# EAGLE design vga_jfet (EAGLE 7.2.0)
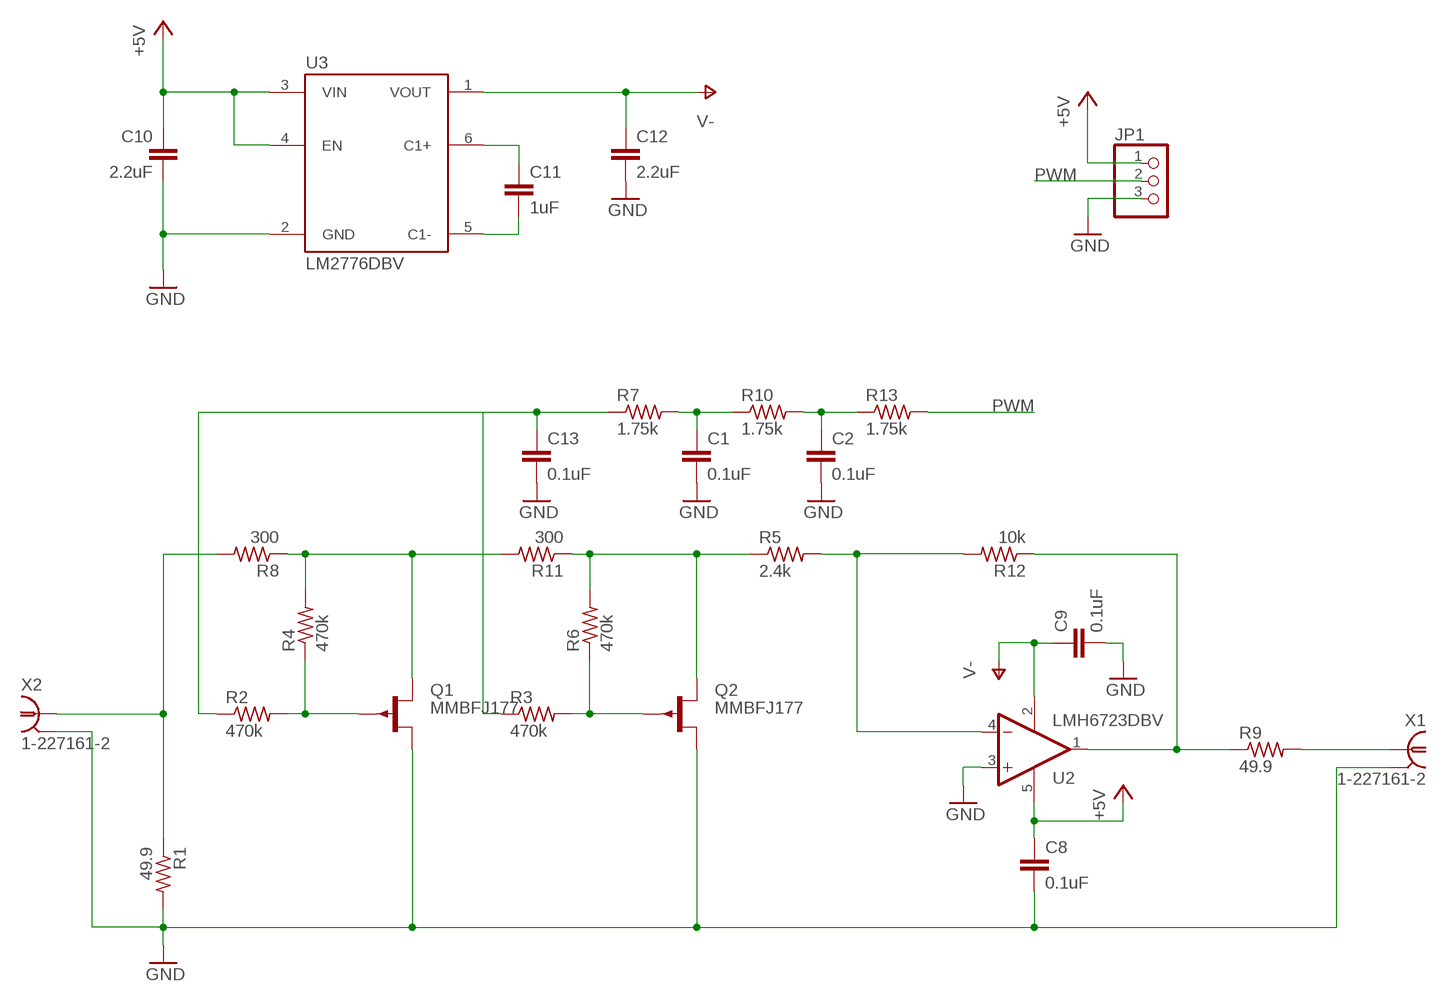
[diagram p0: schematic, sheet 1]

## Parts
C1  0.1uF  C-EUC0603  [C0603]
C2  0.1uF  C-EUC0603  [C0603]
C8  0.1uF  C-EUC0603  [C0603]
C9  0.1uF  C-EUC0603  [C0603]
C10  2.2uF  C-EUC0603  [C0603]
C11  1uF  C-EUC0603  [C0603]
C12  2.2uF  C-EUC0603  [C0603]
C13  0.1uF  C-EUC0603  [C0603]
JP1  PINHD-1X3  [1X03]
Q1  MMBFJ177  [SOT23]
Q2  MMBFJ177  [SOT23]
R1  49.9  R-US_R0603  [R0603]
R2  470k  R-US_R0603  [R0603]
R3  470k  R-US_R0603  [R0603]
R4  470k  R-US_R0603  [R0603]
R5  2.4k  R-US_R0603  [R0603]
R6  470k  R-US_R0603  [R0603]
R7  1.75k  R-US_R0603  [R0603]
R8  300  R-US_R0603  [R0603]
R9  49.9  R-US_R0603  [R0603]
R10  1.75k  R-US_R0603  [R0603]
R11  300  R-US_R0603  [R0603]
R12  10k  R-US_R0603  [R0603]
R13  1.75k  R-US_R0603  [R0603]
U2  LMH6723DBV  [SOT23-DBV]
U3  LM2776DBV  [SOT23-6]
X1  1-227161-2  [AMP_227161]
X2  1-227161-2  [AMP_227161]

## Nets
+5V: C8.1 C10.1 JP1.1 U2.5(V+) U3.3(VIN) U3.4(EN)
GND: C1.2 C2.2 C8.2 C9.2 C10.2 C12.2 C13.2 JP1.3 Q1.1(D) Q2.1(D) R1.2 U2.3(+IN) U3.2(GND) X1.2 X2.2
N$1: C1.1 R7.2 R10.1
N$2: Q2.3(G) R3.2 R6.1
N$3: C2.1 R10.2 R13.1
N$5: Q1.3(G) R2.2 R4.1
N$6: C13.1 R2.1 R3.1 R7.1
N$7: R5.2 R12.2 U2.4(-IN)
N$8: R1.1 R8.2 X2.1
N$9: Q2.2(S) R5.1 R6.2 R11.1
N$10: Q1.2(S) R4.2 R8.1 R11.2
N$12: R9.1 R12.1 U2.1(OUT)
N$13: R9.2 X1.1
N$15: C11.1 U3.6(C1+)
N$16: C11.2 U3.5(C1-)
PWM: JP1.2 R13.2
V-: C9.1 C12.1 U2.2(V-) U3.1(VOUT)

## Library data of the parts
C1 C2 C8-C13 = rcl:C-EU: CAPACITOR, European symbol
JP1 = pinhead:PINHD-1X3: PIN HEADER
Q1 Q2 = transistors:MMBFJ177
R1-R13 = rcl:R-US_: RESISTOR, American symbol
U2 = LMH6723:LMH6723
U3 = lm2776:LM2776
X1 X2 = con-coax:?227161*: JACK, RIGHT ANGLE, 50 OHM, PCB, BNC Source: amp_227161.pdf; OC_FARNELL: unknown; OC_NEWARK: unknown

## Board
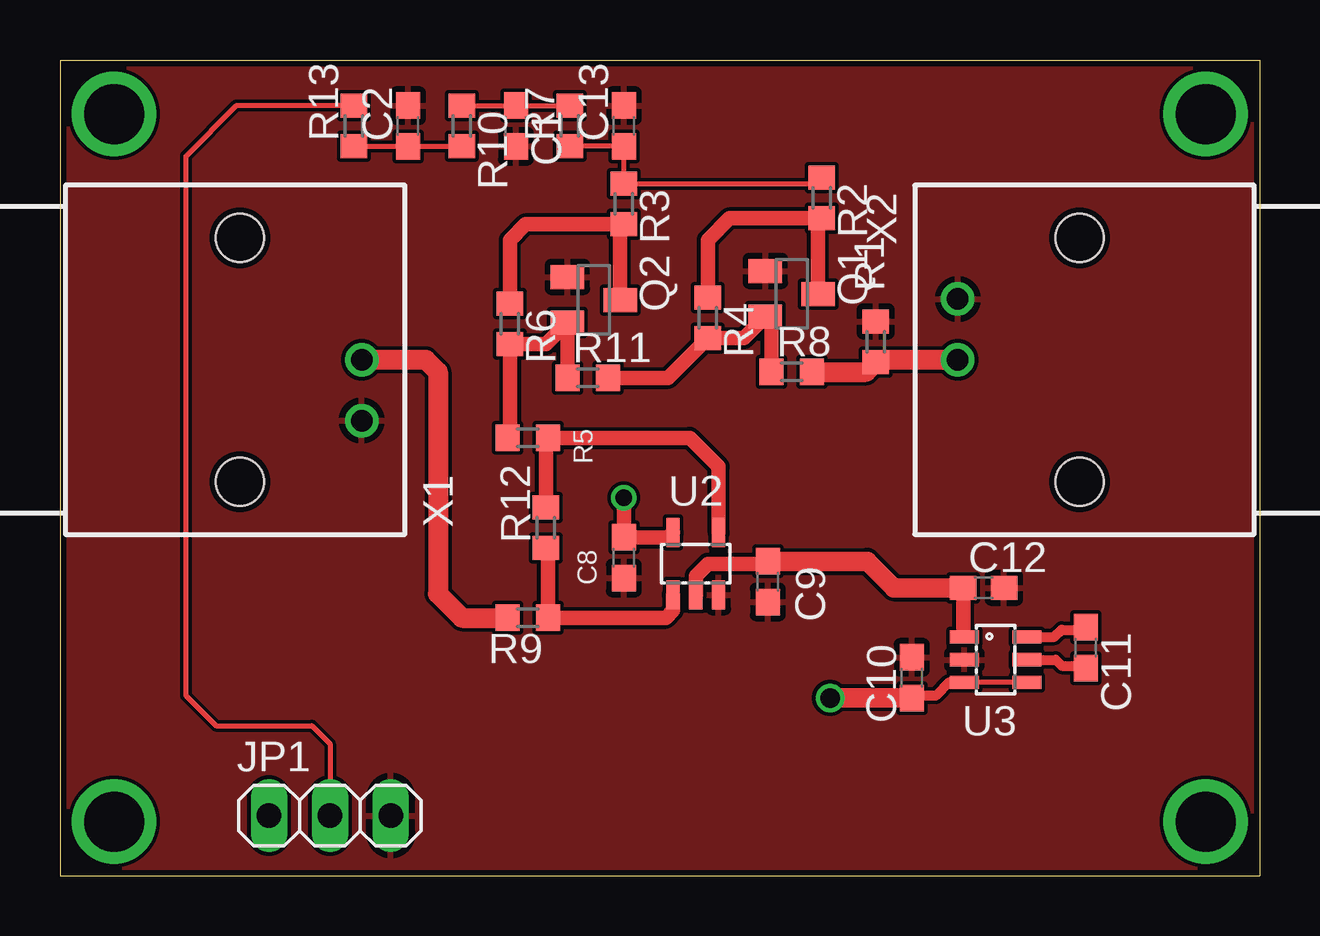
[diagram p1: board, top side]
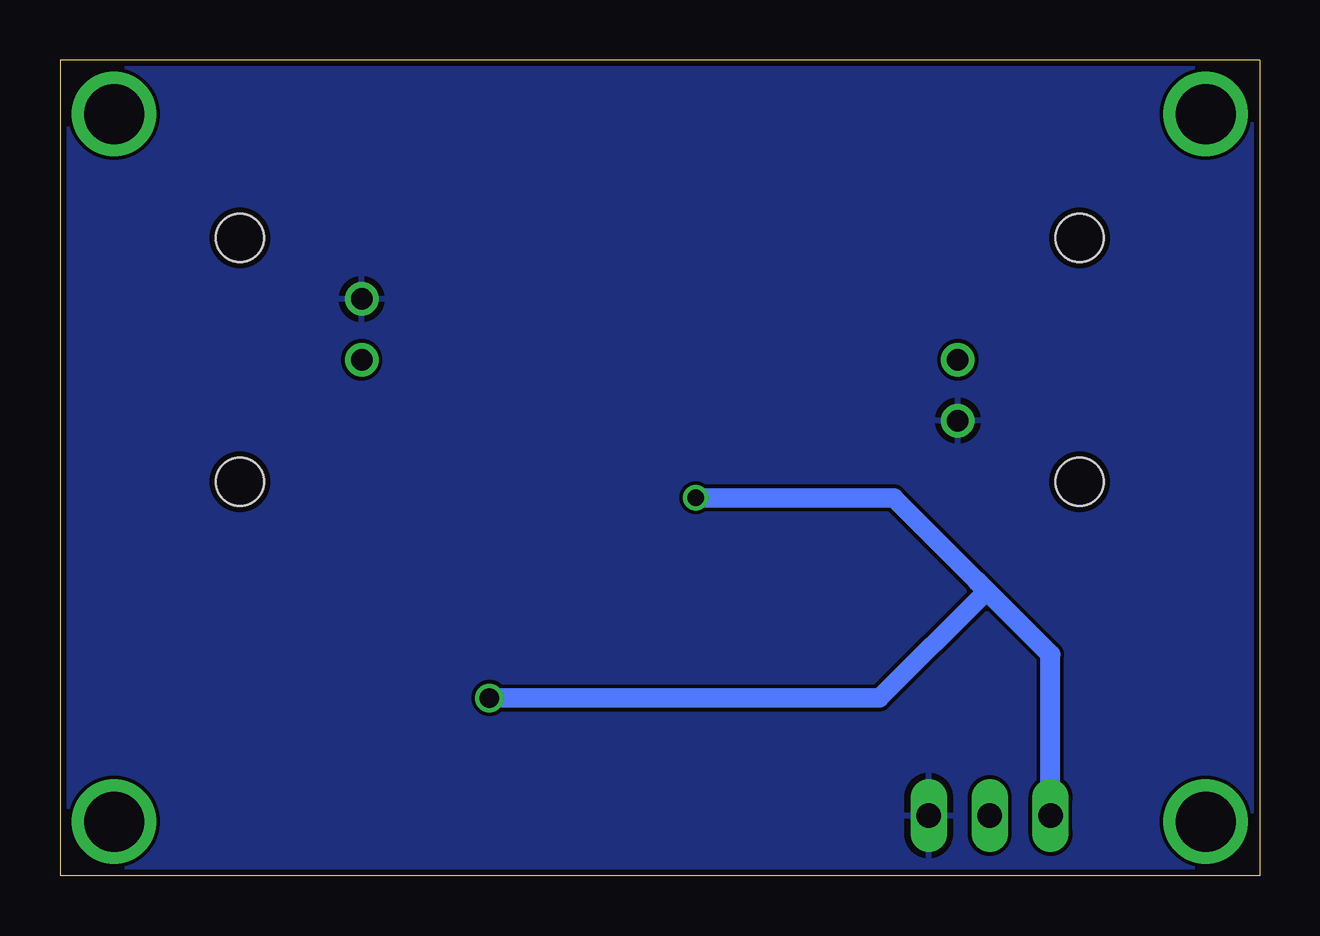
[diagram p2: board, bottom side, seen from below]

Size 50 x 34 mm. Coordinates in mm from the lower left corner, seen from the top.
Outline: 0,34 0,0 50,0 50,34 0,34
Copper layers (1*16): Top 0.035mm / dielectric 1.5mm / Bottom 0.035mm
Design rules "ITEADstudio_DRC": minimum track width 6mil, minimum drill 12mil, track to track 6mil, track to pad 6mil, pad to pad 6mil, via to via 6mil, smd to smd 0mil, copper to edge 10mil, drill to drill 10mil, minimum pad ring 10mil, minimum via ring 6mil, stop-mask expansion 2mil, vias tented up to drill 100mil, thermal gap 10mil

### Footprints (pad centres in the part's own frame; a part is rotated, then mirrored left to right if it is on the bottom)
C0603 = smd 1.1 x 1: 1 -0.85,0; 2 0.85,0
1X03 = drill 1.016 long: 1 -2.54,0; 2 0,0; 3 2.54,0
SOT23 = smd 1 x 1.4: 1 -0.95,-1.1; 2 0.95,-1.1; 3 0,1.1
R0603 = smd 1 x 1.1: 1 -0.85,0; 2 0.85,0
SOT23-DBV = smd 0.55 x 1.2: 1 -0.95,-1.3; 2 0,-1.3; 3 0.95,-1.3; 4 0.95,1.3; 5 -0.95,1.3
SOT23-6 = smd 0.55 x 1.2: 1 -0.95,-1.3; 2 0,-1.3; 3 0.95,-1.3; 4 0.95,1.3; 5 0,1.3; 6 -0.95,1.3
AMP_227161 = drill 0.9 pad 1.27: 1 0,-5.08; 2 -2.54,-5.08 | hole 2: -5.08,0; 5.08,0

### Placement (x,y rotation side)
C1  19,31.25 270 top
C2  14.5,31.25 90 top
C8  23.5,13.25 270 top
C9  29.5,12.25 270 top
C10  35.5,8.25 90 top
C11  42.75,9.5 270 top
C12  38.5,12 0 top
C13  23.5,31.25 90 top
JP1  11.25,2.5 0 top
Q1  30.5,24.25 270 top
Q2  22.25,24 270 top
R1  34,22.25 90 top
R2  31.75,28.25 270 top
R3  23.5,28 270 top
R4  27,23.25 270 top
R5  19.5,18.25 0 top
R6  18.75,23 270 top
R7  21.25,31.25 90 top
R8  30.5,21 0 top
R9  19.5,10.75 180 top
R10  16.75,31.25 270 top
R11  22,20.75 0 top
R12  20.25,14.5 90 top
R13  12.25,31.25 90 top
U2  26.5,13 0 top
U3  39,9 270 top
X1  7.5,21.5 90 top
X2  42.5,21.5 270 top

### Tracks (layer width: path | path; a pad name or v marks a point on that pad's centre or on a via)
+5V  (via drill 0.7, 0.8)
  Top 0.203: U3.4 U3.3
  Top 0.406: U3.3 37.05,8.05 36.5,7.5 35.6,7.5 C10.1
  Top 0.61: v23.5,15.75 C8.1 25.35,14.1 U2.5
  Top 0.813: C10.1 v32.1,7.4
  Bottom 0.813: v23.5,15.75 15.25,15.75 11.75,12.25 11.38,11.88 15.85,7.4 v32.1,7.4
  Bottom 0.83: JP1.1 8.71,9.21 11.75,12.25
GND
  pour Bottom: 0,0 50,0 50,34 0,34
  pour Top: 0,0 50,0 50,34 0,34
N$1
  Top 0.203: R10.1 C1.1 R7.2
N$2
  Top 0.61: Q2.3 23.35,27 R3.2 19.4,27.15 18.75,26.5 R6.1
N$3
  Top 0.203: R13.1 C2.1 R10.2
N$4  (via drill 2.5)
  other vias: 2.25,2.25
N$5
  Top 0.61: Q1.3 31.6,27.25 R2.2 27.9,27.4 27,26.5 R4.1
N$6
  Top 0.203: R7.1 C13.1 R3.1 31.5,28.85 R2.1
N$7
  Top 0.61: U2.4 27.45,17.05 26.25,18.25 R5.2 20.25,18.15 R12.2
N$8
  Top 0.83: X2.1 34.1,21.5 R1.1 33.6,21 R8.2
N$9
  Top 0.61: R11.1 Q2.2 20.25,22.15 R6.2 18.75,18.35 R5.1
N$10
  Top 0.61: R8.1 29.65,23.05 Q1.2 28.5,22.4 R4.2 25.35,20.75 R11.2
N$11  (via drill 2.5)
  other vias: 2.25,31.75
N$12
  Top 0.61: U2.1 25.55,11.05 25.25,10.75 R9.1 20.35,13.55 R12.1
N$13
  Top 0.83: X1.1 15.25,21.5 15.75,21 15.75,11.75 16.75,10.75 R9.2
N$14  (via drill 2.5)
  other vias: 47.75,31.75
N$15
  Top 0.406: U3.6 41.45,9.95 41.75,10.25 42.65,10.25 C11.1
N$16
  Top 0.406: U3.5 41.5,9 41.75,8.75 42.65,8.75 C11.2
N$17  (via drill 2.5)
  other vias: 47.75,2.25
PWM
  Top 0.203: R13.2 7.35,32.1 5.25,30 5.25,7.5 6.5,6.25 10.5,6.25 11.25,5.5 JP1.2
V-
  Top 0.406: 37.65,10 U3.1 | 29.4,13 C9.1
  Top 0.61: 37.65,10 C12.1 | 29.4,13 27,13 26.5,12.5 U2.2
  Top 0.813: C9.1 33.65,13.1 34.75,12 C12.1